# EAGLE design DoublePN-11092017-001 (EAGLE 8.3.1)
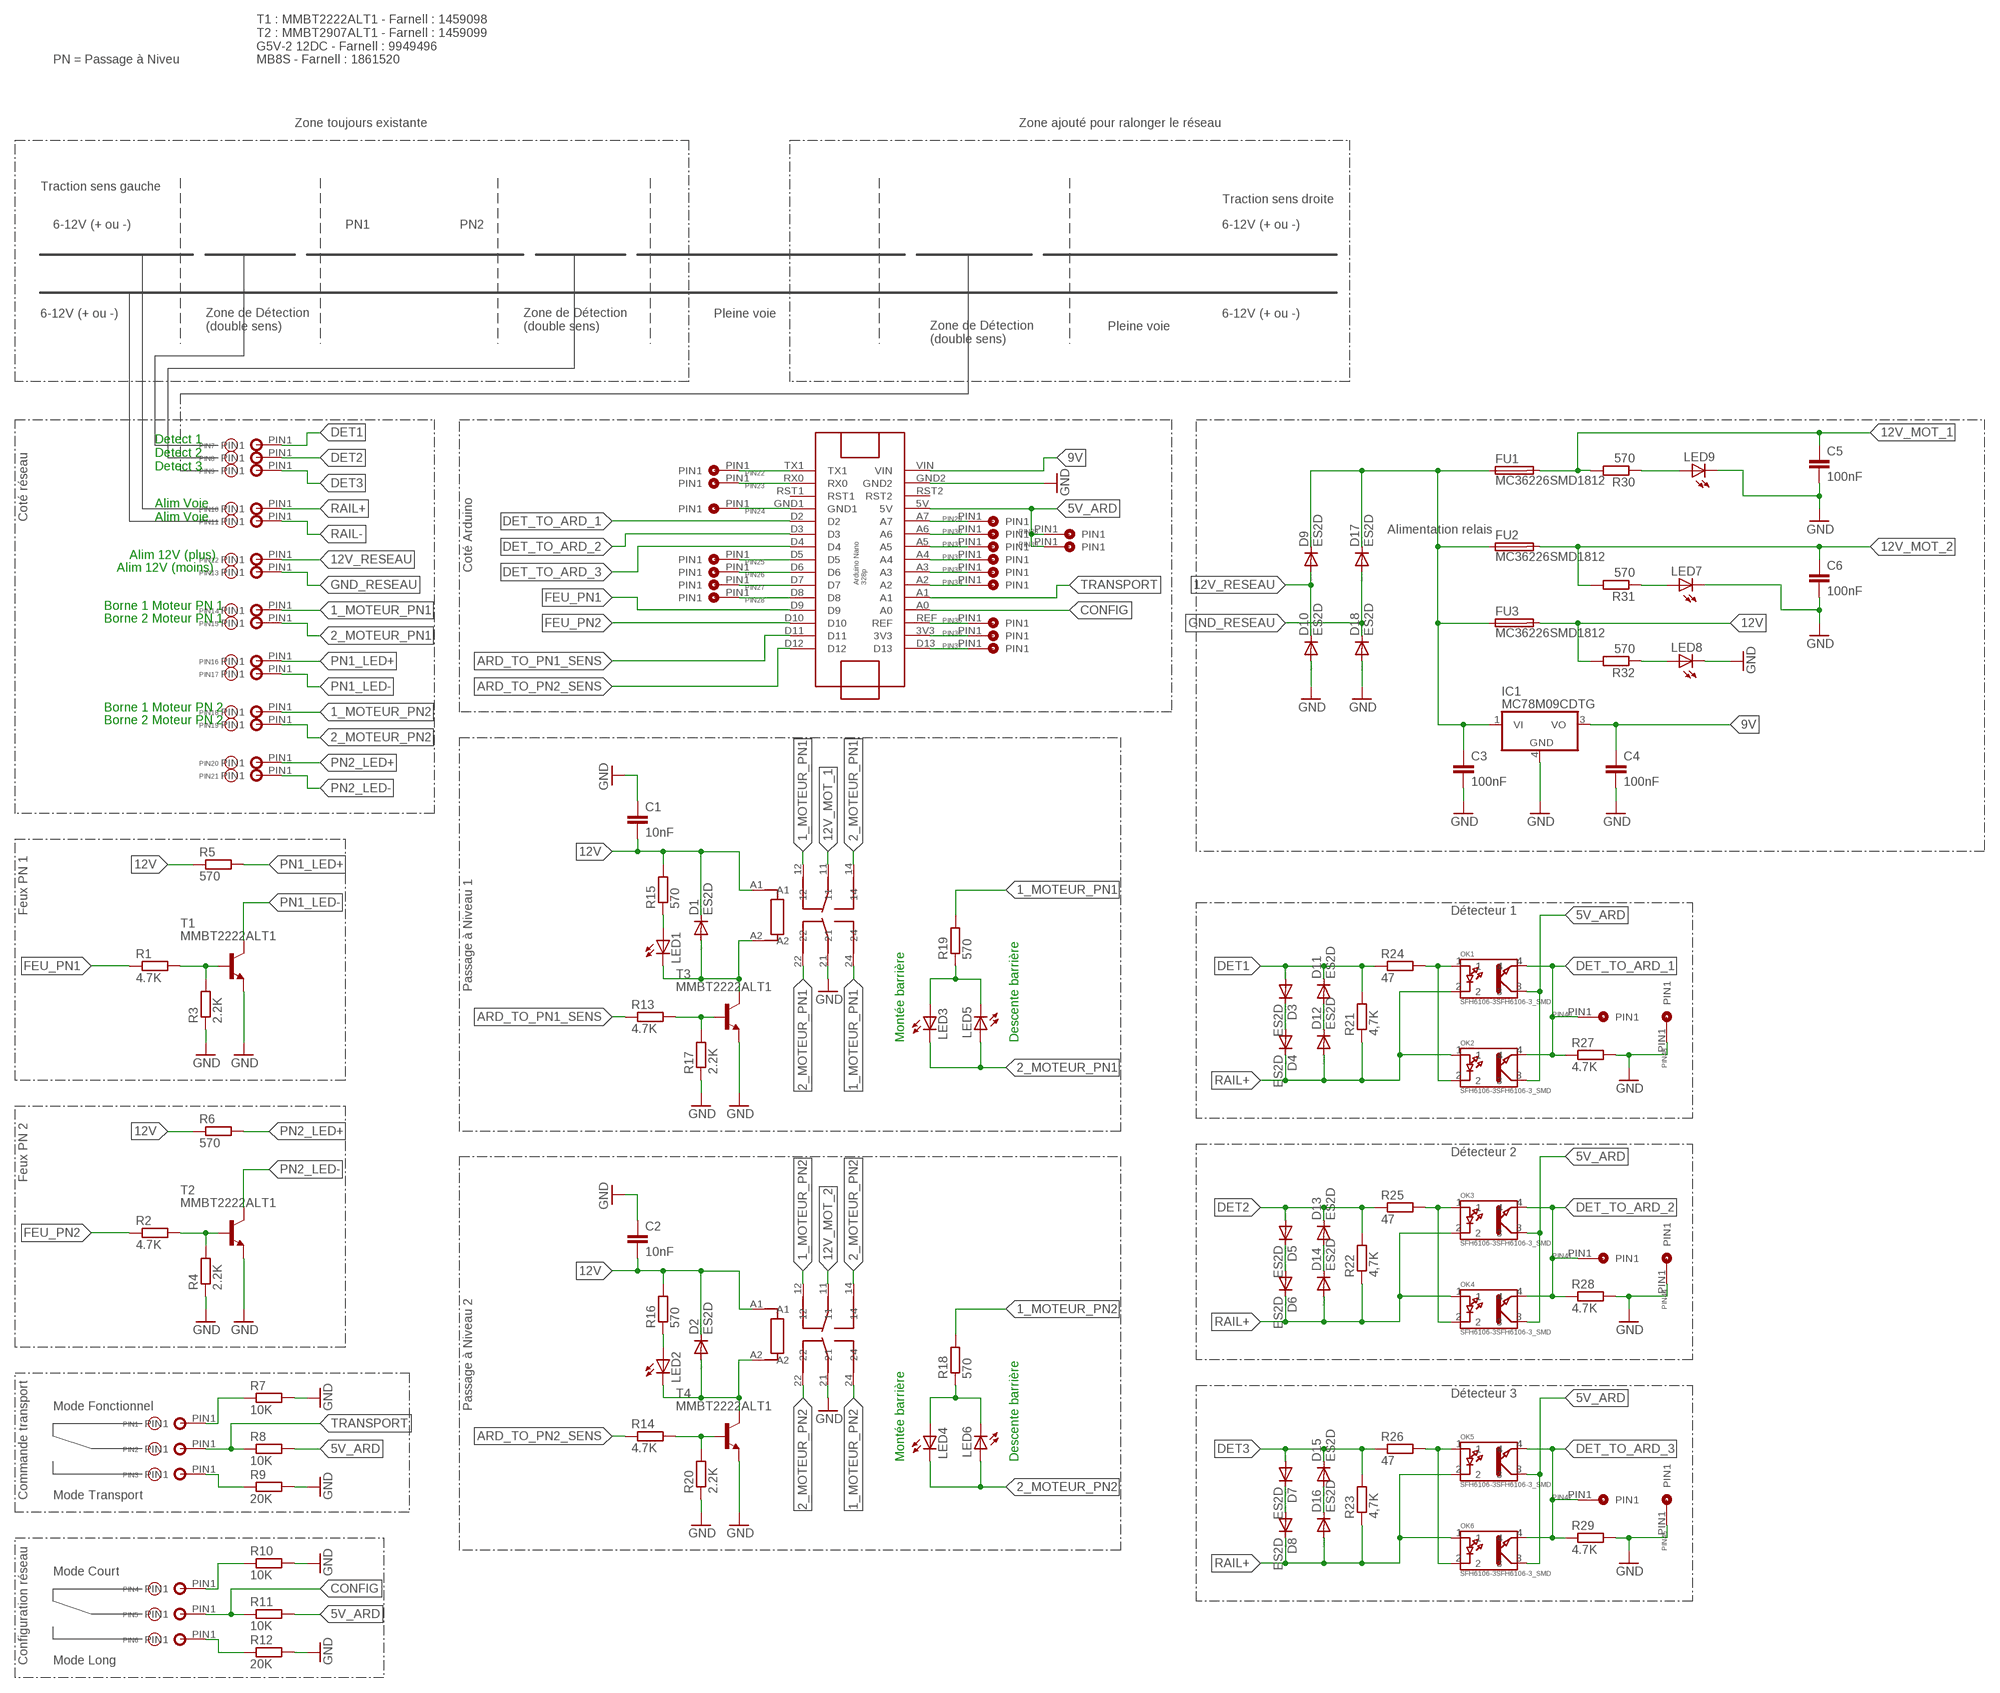
[diagram p0: schematic, sheet 1]

## Parts
ARDUINO-NANO1  ARDUINO-NANO  [ARDUINO-NANO]
C1  10nF  C-EUC0805  [C0805]
C2  10nF  C-EUC0805  [C0805]
C3  100nF  C-EUC0805  [C0805]
C4  100nF  C-EUC0805  [C0805]
C5  100nF  C-EUC0805  [C0805]
C6  100nF  C-EUC0805  [C0805]
D1  ES2D  [SMB]
D2  ES2D  [SMB]
D3  ES2D  [SMB]
D4  ES2D  [SMB]
D5  ES2D  [SMB]
D6  ES2D  [SMB]
D7  ES2D  [SMB]
D8  ES2D  [SMB]
D9  ES2D  [SMB]
D10  ES2D  [SMB]
D11  ES2D  [SMB]
D12  ES2D  [SMB]
D13  ES2D  [SMB]
D14  ES2D  [SMB]
D15  ES2D  [SMB]
D16  ES2D  [SMB]
D17  ES2D  [SMB]
D18  ES2D  [SMB]
FU1  MC36226SMD1812  [MC36226]
FU2  MC36226SMD1812  [MC36226]
FU3  MC36226SMD1812  [MC36226]
IC1  MC78M09CDTG  [DPACK_3]
LED1  LEDCHIPLED_0805  [CHIPLED_0805]
LED2  LEDCHIPLED_0805  [CHIPLED_0805]
LED3  LEDCHIPLED_0805  [CHIPLED_0805]
LED4  LEDCHIPLED_0805  [CHIPLED_0805]
LED5  LEDCHIPLED_0805  [CHIPLED_0805]
LED6  LEDCHIPLED_0805  [CHIPLED_0805]
LED7  LEDCHIPLED_0805  [CHIPLED_0805]
LED8  LEDCHIPLED_0805  [CHIPLED_0805]
LED9  LEDCHIPLED_0805  [CHIPLED_0805]
OK1  SFH6106-3SFH6106-3_SMD  [SFH6106-3]
OK2  SFH6106-3SFH6106-3_SMD  [SFH6106-3]
OK3  SFH6106-3SFH6106-3_SMD  [SFH6106-3]
OK4  SFH6106-3SFH6106-3_SMD  [SFH6106-3]
OK5  SFH6106-3SFH6106-3_SMD  [SFH6106-3]
OK6  SFH6106-3SFH6106-3_SMD  [SFH6106-3]
PIN1  CON-FILTRAVERSANT-1FILTRAVERSANT-1  [CON-FILTRAVERSANT-1]
PIN2  CON-FILTRAVERSANT-1FILTRAVERSANT-1  [CON-FILTRAVERSANT-1]
PIN3  CON-FILTRAVERSANT-1FILTRAVERSANT-1  [CON-FILTRAVERSANT-1]
PIN4  CON-FILTRAVERSANT-1FILTRAVERSANT-1  [CON-FILTRAVERSANT-1]
PIN5  CON-FILTRAVERSANT-1FILTRAVERSANT-1  [CON-FILTRAVERSANT-1]
PIN6  CON-FILTRAVERSANT-1FILTRAVERSANT-1  [CON-FILTRAVERSANT-1]
PIN7  CON-FILTRAVERSANT-1FILTRAVERSANT-1  [CON-FILTRAVERSANT-1]
PIN8  CON-FILTRAVERSANT-1FILTRAVERSANT-1  [CON-FILTRAVERSANT-1]
PIN9  CON-FILTRAVERSANT-1FILTRAVERSANT-1  [CON-FILTRAVERSANT-1]
PIN10  CON-FILTRAVERSANT-1FILTRAVERSANT-1  [CON-FILTRAVERSANT-1]
PIN11  CON-FILTRAVERSANT-1FILTRAVERSANT-1  [CON-FILTRAVERSANT-1]
PIN12  CON-FILTRAVERSANT-1FILTRAVERSANT-1  [CON-FILTRAVERSANT-1]
PIN13  CON-FILTRAVERSANT-1FILTRAVERSANT-1  [CON-FILTRAVERSANT-1]
PIN14  CON-FILTRAVERSANT-1FILTRAVERSANT-1  [CON-FILTRAVERSANT-1]
PIN15  CON-FILTRAVERSANT-1FILTRAVERSANT-1  [CON-FILTRAVERSANT-1]
PIN16  CON-FILTRAVERSANT-1FILTRAVERSANT-1  [CON-FILTRAVERSANT-1]
PIN17  CON-FILTRAVERSANT-1FILTRAVERSANT-1  [CON-FILTRAVERSANT-1]
PIN18  CON-FILTRAVERSANT-1FILTRAVERSANT-1  [CON-FILTRAVERSANT-1]
PIN19  CON-FILTRAVERSANT-1FILTRAVERSANT-1  [CON-FILTRAVERSANT-1]
PIN20  CON-FILTRAVERSANT-1FILTRAVERSANT-1  [CON-FILTRAVERSANT-1]
PIN21  CON-FILTRAVERSANT-1FILTRAVERSANT-1  [CON-FILTRAVERSANT-1]
PIN22  CON-TRAV-1PIN  [CON-TRAV-1]
PIN23  CON-TRAV-1PIN  [CON-TRAV-1]
PIN24  CON-TRAV-1PIN  [CON-TRAV-1]
PIN25  CON-TRAV-1PIN  [CON-TRAV-1]
PIN26  CON-TRAV-1PIN  [CON-TRAV-1]
PIN27  CON-TRAV-1PIN  [CON-TRAV-1]
PIN28  CON-TRAV-1PIN  [CON-TRAV-1]
PIN29  CON-TRAV-1PIN  [CON-TRAV-1]
PIN30  CON-TRAV-1PIN  [CON-TRAV-1]
PIN31  CON-TRAV-1PIN  [CON-TRAV-1]
PIN32  CON-TRAV-1PIN  [CON-TRAV-1]
PIN33  CON-TRAV-1PIN  [CON-TRAV-1]
PIN34  CON-TRAV-1PIN  [CON-TRAV-1]
PIN35  CON-TRAV-1PIN  [CON-TRAV-1]
PIN36  CON-TRAV-1PIN  [CON-TRAV-1]
PIN37  CON-TRAV-1PIN  [CON-TRAV-1]
PIN38  CON-TRAV-1PIN  [CON-TRAV-1]
PIN39  CON-TRAV-1PIN  [CON-TRAV-1]
PIN40  CON-TRAV-1PIN  [CON-TRAV-1]
PIN41  CON-TRAV-1PIN  [CON-TRAV-1]
PIN42  CON-TRAV-1PIN  [CON-TRAV-1]
PIN43  CON-TRAV-1PIN  [CON-TRAV-1]
PIN44  CON-TRAV-1PIN  [CON-TRAV-1]
PIN45  CON-TRAV-1PIN  [CON-TRAV-1]
R1  4.7K  R-EU_R0805  [R0805]
R2  4.7K  R-EU_R0805  [R0805]
R3  2.2K  R-EU_R0805  [R0805]
R4  2.2K  R-EU_R0805  [R0805]
R5  570  R-EU_R0805  [R0805]
R6  570  R-EU_R0805  [R0805]
R7  10K  R-EU_R0805  [R0805]
R8  10K  R-EU_R0805  [R0805]
R9  20K  R-EU_R0805  [R0805]
R10  10K  R-EU_R0805  [R0805]
R11  10K  R-EU_R0805  [R0805]
R12  20K  R-EU_R0805  [R0805]
R13  4.7K  R-EU_R0805  [R0805]
R14  4.7K  R-EU_R0805  [R0805]
R15  570  R-EU_R0805  [R0805]
R16  570  R-EU_R0805  [R0805]
R17  2.2K  R-EU_R0805  [R0805]
R18  570  R-EU_R0805  [R0805]
R19  570  R-EU_R0805  [R0805]
R20  2.2K  R-EU_R0805  [R0805]
R21  4,7K  R-EU_R0805  [R0805]
R22  4,7K  R-EU_R0805  [R0805]
R23  4,7K  R-EU_R0805  [R0805]
R24  47  R-EU_R0805  [R0805]
R25  47  R-EU_R0805  [R0805]
R26  47  R-EU_R0805  [R0805]
R27  4.7K  R-EU_R0805  [R0805]
R28  4.7K  R-EU_R0805  [R0805]
R29  4.7K  R-EU_R0805  [R0805]
R30  570  R-EU_R0805  [R0805]
R31  570  R-EU_R0805  [R0805]
R32  570  R-EU_R0805  [R0805]
RLS1  FINDER-DPDT-12VFINDER-DPDT-12V  [FINDER-DPDT-12V]
RLS2  FINDER-DPDT-12VFINDER-DPDT-12V  [FINDER-DPDT-12V]
T1  MMBT2222ALT1  MMBT2222ALT1-NPN-SOT23-BEC  [SOT23-BEC]
T2  MMBT2222ALT1  MMBT2222ALT1-NPN-SOT23-BEC  [SOT23-BEC]
T3  MMBT2222ALT1  MMBT2222ALT1-NPN-SOT23-BEC  [SOT23-BEC]
T4  MMBT2222ALT1  MMBT2222ALT1-NPN-SOT23-BEC  [SOT23-BEC]

## Nets
1_MOTEUR_PN1: PIN14.PIN1 R19.2 RLS1.12 RLS1.24
1_MOTEUR_PN2: PIN18.PIN1 R18.2 RLS2.12 RLS2.24
2_MOTEUR_PN1: LED3.C LED5.A PIN15.PIN1 RLS1.14 RLS1.22
2_MOTEUR_PN2: LED4.C LED6.A PIN19.PIN1 RLS2.14 RLS2.22
5V_ARD: ARDUINO-NANO1.5V OK1.3 OK2.3 OK3.3 OK4.3 OK5.3 OK6.3 PIN38.PIN1 PIN39.PIN1 R8.2 R11.2
9V: ARDUINO-NANO1.VIN C4.1 IC1.3(VO)
12V: C1.2 C2.2 D1.C D2.C FU3.2 R5.1 R6.1 R15.2 R16.2 R32.2 RLS1.A1 RLS2.A1
12V_MOT_1: C5.1 FU1.2 R30.2 RLS1.11
12V_MOT_2: C6.1 FU2.2 R31.2 RLS2.11
12V_RESEAU: D9.A D10.C PIN12.PIN1
ARD_TO_PN1_SENS: ARDUINO-NANO1.D11 R13.1
ARD_TO_PN2_SENS: ARDUINO-NANO1.D12 R14.1
CONFIG: ARDUINO-NANO1.A0 PIN5.PIN1 R11.1
DET1: D3.A D11.C PIN7.PIN1 R21.2 R24.1
DET2: D5.A D13.C PIN8.PIN1 R22.2 R25.1
DET3: D7.A D15.C PIN9.PIN1 R23.2 R26.1
DET_TO_ARD_1: ARDUINO-NANO1.D2 OK1.4 OK2.4 PIN40.PIN1 R27.1
DET_TO_ARD_2: ARDUINO-NANO1.D3 OK3.4 OK4.4 PIN41.PIN1 R28.1
DET_TO_ARD_3: ARDUINO-NANO1.D4 OK5.4 OK6.4 PIN42.PIN1 R29.1
FEU_PN1: ARDUINO-NANO1.D9 R1.1
FEU_PN2: ARDUINO-NANO1.D10 R2.1
GND: ARDUINO-NANO1.GND2 C1.1 C2.1 C3.2 C4.2 C5.2 C6.2 D10.A D18.A IC1.4(GND) LED7.C LED8.C LED9.C PIN43.PIN1 PIN44.PIN1 PIN45.PIN1 R3.1 R4.1 R7.2 R9.2 R10.2 R12.2 R17.1 R20.1 R27.2 R28.2 R29.2 RLS1.21 RLS2.21 T1.E T2.E T3.E T4.E
GND_RESEAU: D17.A D18.C PIN13.PIN1
N$1: OK1.1 OK2.2 R24.2
N$2: D3.C D4.A
N$3: D11.A D12.C
N$4: LED3.A LED5.C R19.1
N$5: R13.2 R17.2 T3.B
N$6: D5.C D6.A
N$7: D1.A LED1.C RLS1.A2 T3.C
N$8: D13.A D14.C
N$9: LED1.A R15.1
N$10: OK3.1 OK4.2 R25.2
N$11: D7.C D8.A
N$12: D15.A D16.C
N$13: OK5.1 OK6.2 R26.2
N$14: D2.A LED2.C RLS2.A2 T4.C
N$15: LED9.A R30.1
N$16: LED4.A LED6.C R18.1
N$17: R14.2 R20.2 T4.B
N$18: LED2.A R16.1
N$19: ARDUINO-NANO1.GND1 PIN24.PIN1
N$20: R2.2 R4.2 T2.B
N$21: ARDUINO-NANO1.D7 PIN27.PIN1
N$22: R1.2 R3.2 T1.B
N$23: ARDUINO-NANO1.D8 PIN28.PIN1
N$24: LED7.A R31.1
N$25: ARDUINO-NANO1.A7 PIN29.PIN1
N$26: ARDUINO-NANO1.A6 PIN30.PIN1
N$27: ARDUINO-NANO1.A5 PIN31.PIN1
N$28: ARDUINO-NANO1.A4 PIN32.PIN1
N$29: ARDUINO-NANO1.A3 PIN33.PIN1
N$30: ARDUINO-NANO1.A2 PIN34.PIN1
N$33: ARDUINO-NANO1.D6 PIN26.PIN1
N$34: ARDUINO-NANO1.D5 PIN25.PIN1
N$35: ARDUINO-NANO1.RX0 PIN23.PIN1
N$36: ARDUINO-NANO1.TX1 PIN22.PIN1
N$37: PIN4.PIN1 R10.1
N$38: PIN1.PIN1 R7.1
N$39: ARDUINO-NANO1.REF PIN35.PIN1
N$40: ARDUINO-NANO1.3V3 PIN36.PIN1
N$41: ARDUINO-NANO1.D13 PIN37.PIN1
N$42: PIN6.PIN1 R12.1
N$43: PIN3.PIN1 R9.1
N$44: C3.1 D9.C D17.C FU1.1 FU2.1 FU3.1 IC1.1(VI)
N$45: LED8.A R32.1
PN1_LED+: PIN16.PIN1 R5.2
PN1_LED-: PIN17.PIN1 T1.C
PN2_LED+: PIN20.PIN1 R6.2
PN2_LED-: PIN21.PIN1 T2.C
RAIL+: D4.C D6.C D8.C D12.A D14.A D16.A OK1.2 OK2.1 OK3.2 OK4.1 OK5.2 OK6.1 PIN10.PIN1 R21.1 R22.1 R23.1
RAIL-: PIN11.PIN1
TRANSPORT: ARDUINO-NANO1.A1 PIN2.PIN1 R8.1
Unconnected: ARDUINO-NANO1.RST1 ARDUINO-NANO1.RST2

## Notes on the sheet
- PN = Passage à Niveu
- T1 : MMBT2222ALT1 - Farnell : 1459098
  T2 : MMBT2907ALT1 - Farnell : 1459099
  G5V-2 12DC - Farnell : 9949496
  MB8S - Farnell : 1861520
- Zone toujours existante | Zone ajouté pour ralonger le réseau
- Traction sens gauche
- Traction sens droite
- 6-12V (+ ou -) | PN1 | PN2 | 6-12V (+ ou -)
- 6-12V (+ ou -) | Pleine voie | 6-12V (+ ou -)
- Zone de Détection
  (double sens)
- Zone de Détection
  (double sens)
- Pleine voie
- Zone de Détection
  (double sens)
- Detect 1
  Detect 2
  Detect 3
- Coté réseau
- Alim Voie
  Alim Voie
- Alimentation relais
- Alim 12V (plus)
- Alim 12V (moins) | Coté Arduino
- Borne 1 Moteur PN 1
- Borne 2 Moteur PN 1
- Borne 1 Moteur PN 2
- Borne 2 Moteur PN 2
- Feux PN 1 | Détecteur 1
- Passage à Niveau 1
- Montée barrière | Descente barrière
- Détecteur 2
- Feux PN 2
- Détecteur 3
- Mode Fonctionnel | Passage à Niveau 2
- Montée barrière | Descente barrière
- Commande transport | Mode Transport
- Mode Court
- Configuration réseau | Mode Long

## Library data of the parts
ARDUINO-NANO1 = Arduino-nano:ARDUINO-NANO
C1-C6 = rcl:C-EU: CAPACITOR, European symbol
D1-D18 = diode:ES2D: DIODE super fast rectifier, 2 A
FU1-FU3 = Alex-Poly:MC36226
IC1 = linear:MC78M: 500 mA Positive Voltage Regulators Source: Data sheet <http://www.onsemi.com/pub_link/Collateral/MC78M00-D.PDF>
LED1-LED9 = led:LED: LED OSRAM: - CHIPLED LG R971, LG N971, LY N971, LG Q971, LY Q971, LO R971, LY R971 LH N974, LH R974 LS Q976, LO Q976, LY Q976 LO Q996 - Hyper CHIPLED LW Q18S LB Q993, LB Q99A, LB R99A - SideLED LS A670, LO A670, LY A670, LG A670, LP A670 LB A673, LV A673, LT A673, LW A673 LH A674 LY A675 LS A676, LA A676, LO A676, LY A676, LW A676 LS A679, LY A679, LG A679 - Hyper Micro SIDELED® LS Y876, LA Y876, LO Y876, LY Y876 LT Y87S - SmartLED LW L88C, LW L88S LB L89C, LB L89S, LG L890 LS L89K, LO L89K, LY L89K LS L896, LA L896, LO L896, LY L896 - TOPLED LS T670, LO T670, LY T670, LG T670, LP T670 LSG T670, LSP T670, LSY T670, LOP T670, LYG T670 LG T671, LOG T671, LSG T671 LB T673, LV T673, LT T673, LW T673 LH T674 LS T676, LA T676, LO T676, LY T676, LB T676, LH T676, LSB T676, LW T676 LB T67C, LV T67C, LT T67C, LS T67K, LO T67K, LY T67K, LW E67C LS E67B, LA E67B, LO E67B, LY E67B, LB E67C, LV E67C, LT E67C LW T67C LS T679, LY T679, LG T679 LS T770, LO T770, LY T770, LG T770, LP T770 LB T773, LV T773, LT T773, LW T773 LH T774 LS E675, LA E675, LY E675, LS T675 LS T776, LA T776, LO T776, LY T776, LB T776 LHGB T686 LT T68C, LB T68C - Hyper Mini TOPLED® LB M676 - Mini TOPLED Santana® LG M470 LS M47K, LO M47K, LY M47K Source: http://www.osram.convergy.de LUXEON: - LUMILED® LXK2-PW12-R00, LXK2-PW12-S00, LXK2-PW14-U00, LXK2-PW14-V00 LXK2-PM12-R00, LXK2-PM12-S00, LXK2-PM14-U00 LXK2-PE12-Q00, LXK2-PE12-R00, LXK2-PE12-S00, LXK2-PE14-T00, LXK2-PE14-U00 LXK2-PB12-K00, LXK2-PB12-L00, LXK2-PB12-M00, LXK2-PB14-N00, LXK2-PB14-P00, LXK2-PB14-Q00 LXK2-PR12-L00, LXK2-PR12-M00, LXK2-PR14-Q00, LXK2-PR14-R00 LXK2-PD12-Q00, LXK2-PD12-R00, LXK2-PD12-S00 LXK2-PH12-R00, LXK2-PH12-S00 LXK2-PL12-P00, LXK2-PL12-Q00, LXK2-PL12-R00 Source: www.luxeon.com KINGBRIGHT: KA-3528ASYC Source: www.kingbright.com
OK1-OK6 = Alex-Optocoupler:SFH6106-3
PIN1-PIN21 = Pin:CON-FILTRAVERSANT-1
PIN22-PIN45 = Pin:CON-TRAV-1
R1-R32 = rcl:R-EU_: RESISTOR, European symbol
RLS1 RLS2 = Alex-Relay:FINDER-DPDT-12V
T1-T4 = transistor:*-NPN-: NPN Transistror BF959 corrected 2008.03.06

## Board
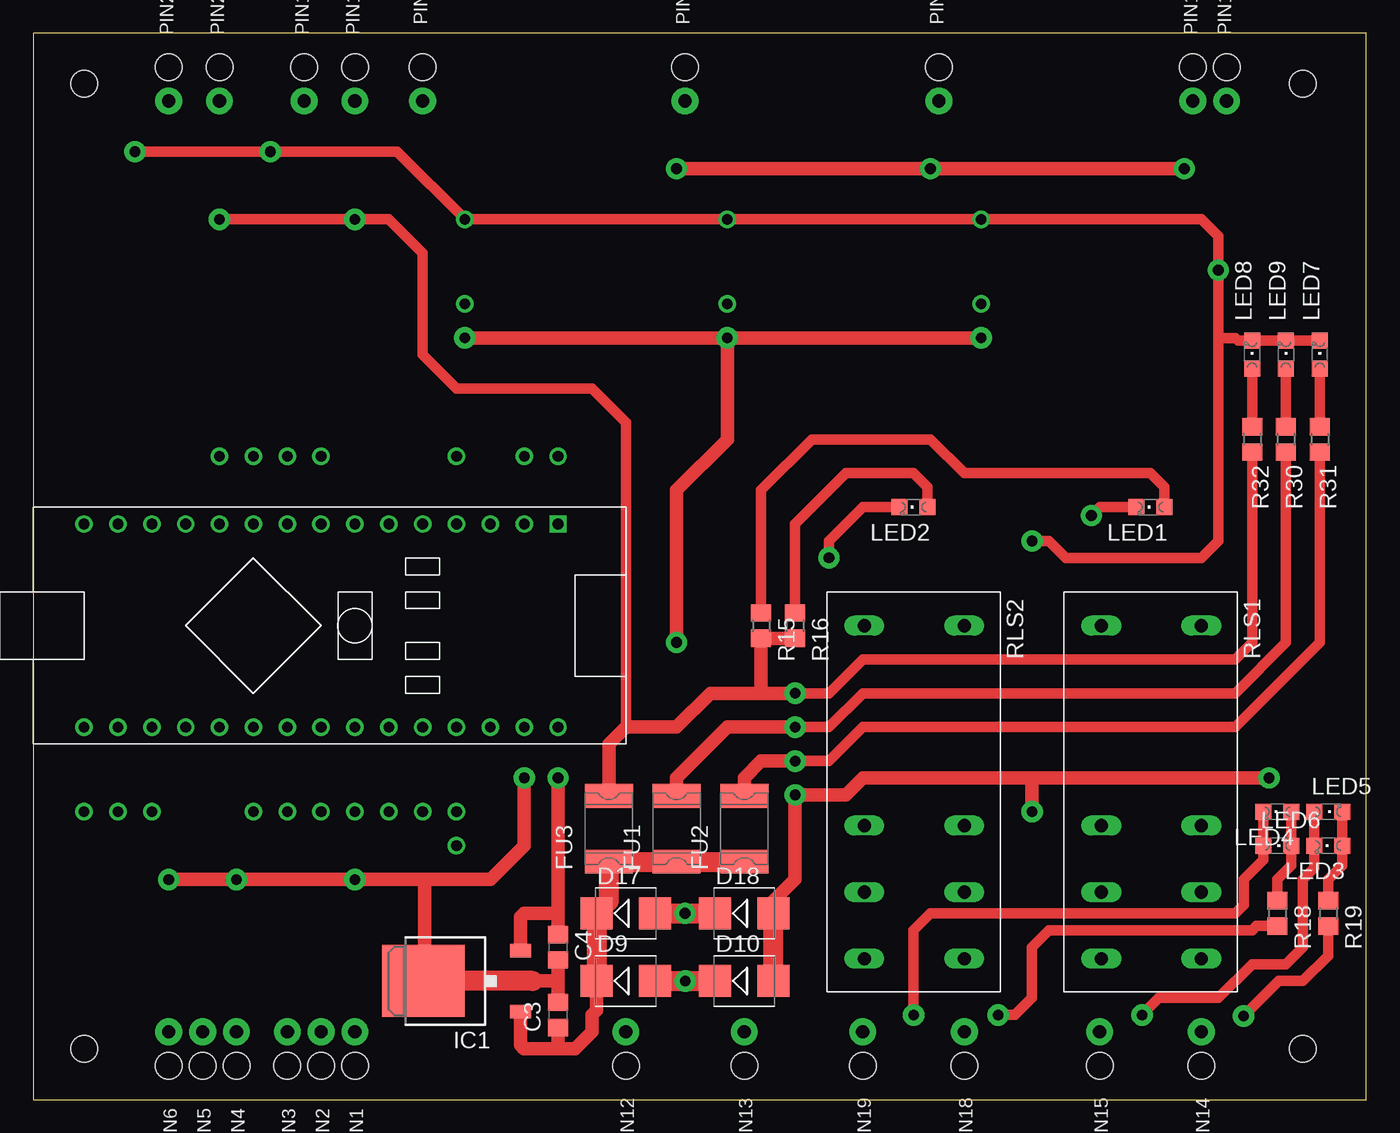
[diagram p1: board, top side]
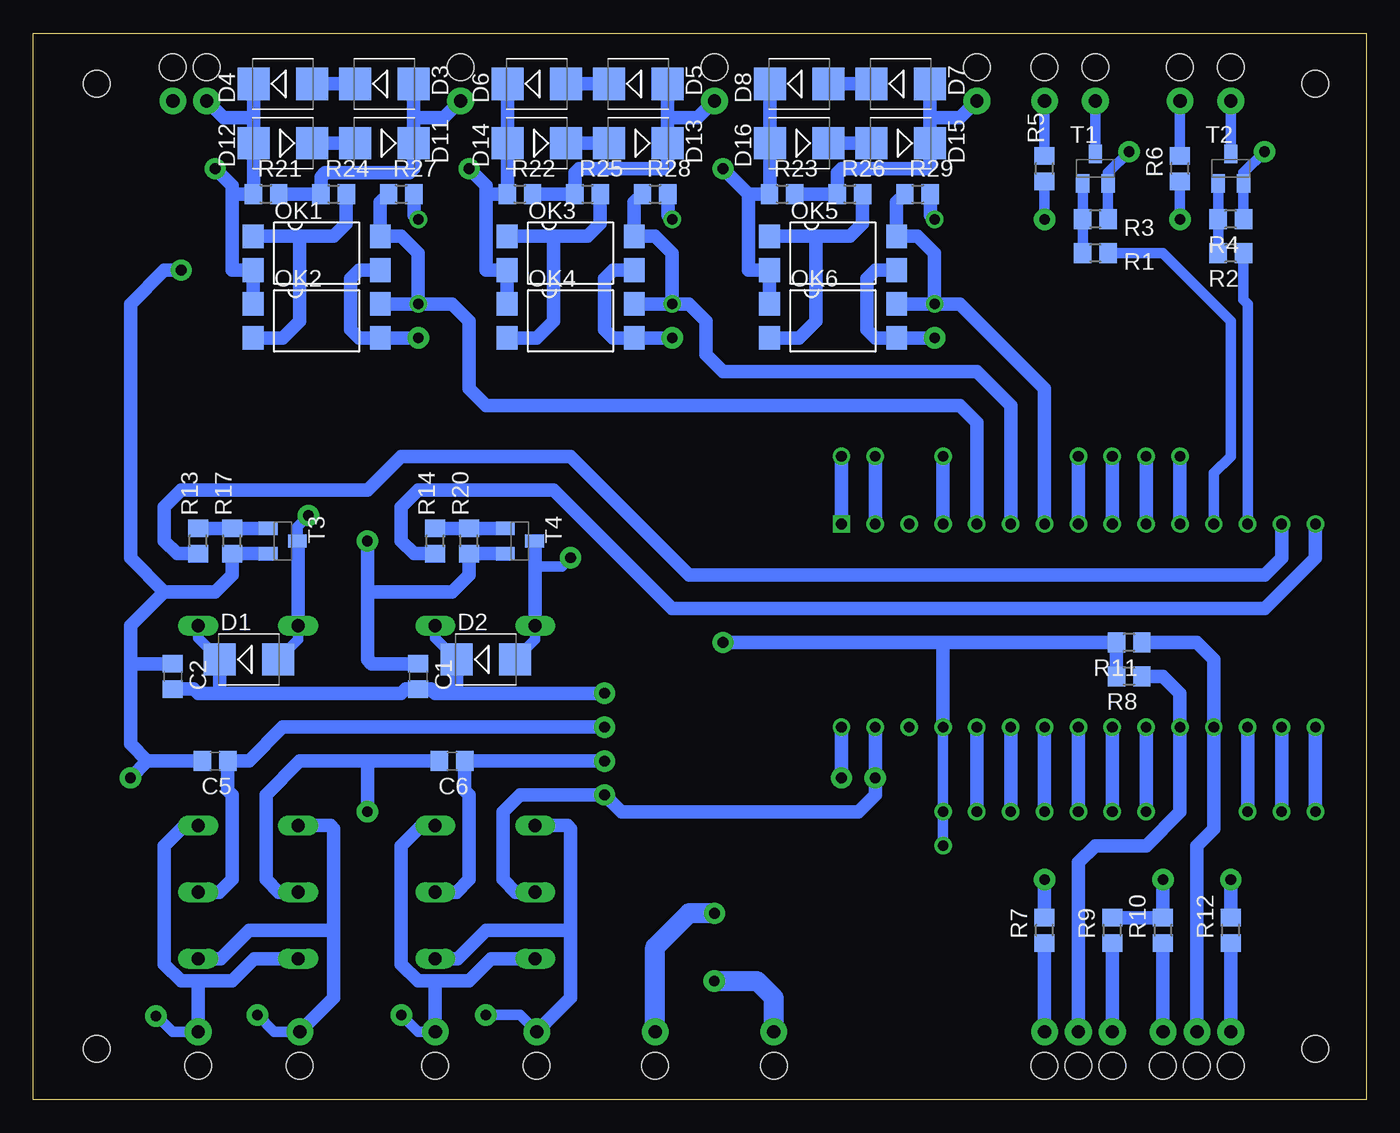
[diagram p2: board, bottom side, seen from below]

Size 100 x 80 mm. Coordinates in mm from the lower left corner, seen from the top.
Outline: 0,0 100,0 100,80 0,80 0,0
Copper layers (1*16): Top 0.035mm / dielectric 1.5mm / Bottom 0.035mm
Design rules "default": minimum track width 6mil, minimum drill 0.35mm, track to track 6mil, track to pad 6mil, pad to pad 6mil, via to via 6mil, smd to smd 6mil, copper to edge 40mil, drill to drill 6mil, minimum pad ring 10mil, minimum via ring 8mil, stop-mask expansion 4mil, vias tented up to drill 0mil, thermal gap 10mil
Holes 2 mm at 3.81,76.2 95.25,76.2 95.25,3.81 3.81,3.81

### Footprints (pad centres in the part's own frame; a part is rotated, then mirrored left to right if it is on the bottom)
ARDUINO-NANO = drill 0.8: 3V3 7.62,-16.51; 5V 7.62,8.89; A0 7.62,-11.43; A1 7.62,-8.89; A2 7.62,-6.35; A3 7.62,-3.81; A4 7.62,-1.27; A5 7.62,1.27; A6 7.62,3.81; A7 7.62,6.35; D2 -7.62,6.35; D3 -7.62,3.81; D4 -7.62,1.27; D5 -7.62,-1.27; D6 -7.62,-3.81; D7 -7.62,-6.35; D8 -7.62,-8.89; D9 -7.62,-11.43; D10 -7.62,-13.97; D11 -7.62,-16.51; D12 -7.62,-19.05; D13 7.62,-19.05; GND1 -7.62,8.89; GND2 7.62,13.97; REF 7.62,-13.97; RST1 -7.62,11.43; RST2 7.62,11.43; RX0 -7.62,13.97; VIN 7.62,16.51 | drill 0.8 square: TX1 -7.62,16.51
C0805 = smd 1.3 x 1.5: 1 -0.95,0; 2 0.95,0
SMB = smd 2.4 x 2.4: A 2.2,0; C -2.2,0
MC36226 = smd 1.78 x 3.6: 1 -2.47,0; 2 2.47,0
DPACK_3 = smd 1 x 1.6: 1 -2.28,-4.8; 3 2.28,-4.8 | smd 5.4 x 6.2: 4 0,2.5
CHIPLED_0805 = smd 1.2 x 1.2: A 0,-1.05; C 0,1.05
SFH6106-3 = smd 1.78 x 1.55: 1 -1.27,-4.77; 2 1.27,-4.77; 3 1.27,4.77; 4 -1.27,4.77
CON-FILTRAVERSANT-1 = drill 1 pad 2: PIN1 0,0 | hole 2: -2.54,0
CON-TRAV-1 = drill 0.8 pad 1.2: PIN1 0,0
R0805 = smd 1.3 x 1.5: 1 -0.95,0; 2 0.95,0
FINDER-DPDT-12V = drill 1 long: 11 -3.81,6.03; 12 -3.81,1.03; 14 -3.81,11.03; 21 3.69,6.03; 22 3.69,1.03; 24 3.69,11.03; A1 -3.81,-13.97; A2 3.69,-13.97
SOT23-BEC = smd 1 x 1.4: B -0.95,-1.1; C 0,1.1; E 0.95,-1.1

### Placement (x,y rotation side)
ARDUINO-NANO1  22.86,35.56 270 top
C1  71.12,31.75 270 bottom
C2  89.53,31.75 270 bottom
C3  39.37,6.35 90 top
C4  39.37,11.43 270 top
C5  86.36,25.4 180 bottom
C6  68.58,25.4 180 bottom
D1  83.82,33.02 0 bottom
D2  66.04,33.02 0 bottom
D3  73.66,76.2 0 bottom
D4  81.28,76.2 0 bottom
D5  54.61,76.2 0 bottom
D6  62.23,76.2 0 bottom
D7  34.92,76.2 0 bottom
D8  42.55,76.2 0 bottom
D9  44.45,8.89 0 top
D10  53.34,8.89 0 top
D11  73.66,71.75 180 bottom
D12  81.28,71.75 180 bottom
D13  54.61,71.75 180 bottom
D14  62.23,71.75 180 bottom
D15  34.92,71.75 180 bottom
D16  42.55,71.75 180 bottom
D17  44.45,13.97 0 top
D18  53.34,13.97 0 top
FU1  48.26,20.32 90 top
FU2  53.34,20.32 90 top
FU3  43.18,20.32 90 top
IC1  31.75,8.89 90 top
LED1  83.82,44.45 90 top
LED2  66.04,44.45 90 top
LED3  97.16,19.05 90 top
LED4  93.34,21.59 90 top
LED5  97.16,21.59 270 top
LED6  93.34,19.05 270 top
LED7  96.52,55.88 0 top
LED8  91.44,55.88 0 top
LED9  93.98,55.88 0 top
OK1  78.74,63.5 270 bottom
OK2  78.74,58.42 270 bottom
OK3  59.69,63.5 270 bottom
OK4  59.69,58.42 270 bottom
OK5  40.01,63.5 270 bottom
OK6  40.01,58.42 270 bottom
PIN1  24.13,5.08 90 top
PIN2  21.59,5.08 90 top
PIN3  19.05,5.08 90 top
PIN4  15.24,5.08 90 top
PIN5  12.7,5.08 90 top
PIN6  10.16,5.08 90 top
PIN7  67.94,74.93 270 top
PIN8  48.9,74.93 270 top
PIN9  29.21,74.93 270 top
PIN10  87,74.93 270 top
PIN11  89.53,74.93 270 top
PIN12  44.45,5.08 90 top
PIN13  53.34,5.08 90 top
PIN14  87.63,5.08 90 top
PIN15  80.01,5.08 90 top
PIN16  24.13,74.93 270 top
PIN17  20.32,74.93 270 top
PIN18  69.85,5.08 90 top
PIN19  62.23,5.08 90 top
PIN20  13.97,74.93 270 top
PIN21  10.16,74.93 270 top
PIN22  39.37,48.26 0 top
PIN23  36.83,48.26 0 top
PIN24  31.75,48.26 0 top
PIN25  21.59,48.26 0 top
PIN26  19.05,48.26 0 top
PIN27  16.51,48.26 0 top
PIN28  13.97,48.26 0 top
PIN29  29.21,21.59 0 top
PIN30  26.67,21.59 0 top
PIN31  24.13,21.59 0 top
PIN32  21.59,21.59 0 top
PIN33  19.05,21.59 0 top
PIN34  16.51,21.59 0 top
PIN35  8.89,21.59 0 top
PIN36  6.35,21.59 0 top
PIN37  3.81,21.59 0 top
PIN38  31.75,21.59 0 top
PIN39  31.75,19.05 0 top
PIN40  71.12,59.69 90 bottom
PIN41  52.07,59.69 0 top
PIN42  32.38,59.69 0 top
PIN43  71.12,66.04 0 top
PIN44  52.07,66.04 0 top
PIN45  32.38,66.04 0 top
R1  20.32,63.5 180 bottom
R2  10.16,63.5 180 bottom
R3  20.32,66.04 180 bottom
R4  10.16,66.04 180 bottom
R5  24.13,69.85 90 bottom
R6  13.97,69.85 90 bottom
R7  24.13,12.7 90 bottom
R8  17.78,31.75 180 bottom
R9  19.05,12.7 90 bottom
R10  15.24,12.7 90 bottom
R11  17.78,34.29 180 bottom
R12  10.16,12.7 90 bottom
R13  87.63,41.91 90 bottom
R14  69.85,41.91 90 bottom
R15  54.61,35.56 270 top
R16  57.15,35.56 270 top
R17  85.09,41.91 90 bottom
R18  93.34,13.97 270 top
R19  97.16,13.97 270 top
R20  67.31,41.91 90 bottom
R21  82.55,67.94 0 bottom
R22  63.5,67.94 0 bottom
R23  43.81,67.94 0 bottom
R24  77.47,67.94 0 bottom
R25  58.42,67.94 0 bottom
R26  38.73,67.94 0 bottom
R27  72.39,67.94 0 bottom
R28  53.34,67.94 0 bottom
R29  33.66,67.94 0 bottom
R30  93.98,49.53 270 top
R31  96.52,49.53 270 top
R32  91.44,49.53 270 top
RLS1  83.82,21.59 180 top
RLS2  66.04,21.59 180 top
T1  20.32,69.85 0 bottom
T2  10.16,69.85 0 bottom
T3  81.28,41.91 270 bottom
T4  63.5,41.91 270 bottom

### Tracks (layer width: path | path; a pad name or v marks a point on that pad's centre or on a via)
1_MOTEUR_PN1  (via drill 0.8 pad 1.6)
  Top 0.8: v90.81,6.27 93.43,8.89 95.25,8.89 97.16,10.79 R19.2
  Bottom 0.8: PIN14.PIN1 89.53,5.08 90.81,6.35 v90.81,6.27
  Bottom 1: RLS1.12 88.66,20.56 90.17,19.05 90.17,10.16 88.9,8.89 87.63,8.89 | 87.63,8.89 85.09,8.89 83.42,10.56 RLS1.24 | 87.63,8.89 PIN14.PIN1
1_MOTEUR_PN2  (via drill 0.8 pad 1.6)
  Top 0.8: v72.39,6.35 73.66,6.35 74.93,7.62 74.93,11.43 76.2,12.7 91.44,12.7 91.76,13.02 R18.2
  Bottom 0.8: PIN18.PIN1 71.12,5.08 v72.39,6.35
  Bottom 1: RLS2.24 65.64,10.56 67.31,8.89 69.85,8.89 | 69.85,8.89 71.12,8.89 72.39,10.16 72.39,19.05 70.88,20.56 RLS2.12 | 69.85,8.89 PIN18.PIN1
2_MOTEUR_PN1  (via drill 0.8 pad 1.6)
  Top 0.8: v83.19,6.35 84.45,7.62 88.9,7.62 91.44,10.16 93.98,10.16 95.25,11.43 95.25,16.51 96.11,17.36 LED3.C LED5.A
  Bottom 0.8: PIN15.PIN1 81.92,5.08 v83.19,6.35
  Bottom 1: RLS1.14 85.96,10.56 83.82,12.7 77.47,12.7 | RLS1.22 77.71,20.56 77.47,20.32 77.47,12.7 | 77.47,12.7 77.47,7.62 PIN15.PIN1
2_MOTEUR_PN2  (via drill 0.8 pad 1.6)
  Top 0.8: v66.04,6.35 66.04,12.7 67.31,13.97 90.17,13.97 90.81,14.61 90.81,16.51 92.3,18 LED6.A LED4.C
  Bottom 0.8: PIN19.PIN1 63.5,6.35 v66.04,6.35
  Bottom 1: RLS2.14 68.18,10.56 66.04,12.7 59.97,12.7 59.69,12.98 | RLS2.22 59.93,20.56 59.69,20.32 59.69,12.98 | 59.69,12.98 59.69,7.62 PIN19.PIN1
5V_ARD  (via drill 0.8 pad 1.6)
  Top 1: v32.38,57.15 v52.07,57.15 | v48.26,34.29 48.26,45.72 52.07,49.53 v52.07,57.15 | v52.07,57.15 v71.12,57.15
  Bottom 0.8: ARDUINO-NANO1.5V PIN38.PIN1 PIN39.PIN1
  Bottom 1: OK1.3 75.56,62.23 76.2,61.59 76.2,57.78 75.56,57.15 OK2.3 v71.12,57.15 | OK3.3 56.52,62.23 57.15,61.59 57.15,57.78 56.52,57.15 OK4.3 v52.07,57.15 | OK5.3 36.83,62.23 37.47,61.59 37.47,57.78 36.83,57.15 OK6.3 v32.38,57.15 | R8.2 R11.2 31.75,34.29 | 31.75,34.29 ARDUINO-NANO1.5V | 31.75,34.29 v48.26,34.29
9V  (via drill 0.8 pad 1.6)
  Top 1: IC1.3 36.55,13.69 36.83,13.97 39.37,13.97 | C4.1 39.37,13.97 | 39.37,13.97 v39.37,24.13
  Bottom 1: v39.37,24.13 ARDUINO-NANO1.VIN
12V  (via drill 0.8 pad 1.6)
  Top 0.8: 57.15,30.61 57.28,30.48 v57.15,30.48 59.69,30.48 62.23,33.02 90.17,33.02 91.44,34.29 R32.2 | v13.97,66.04 v24.13,66.04 26.67,66.04 29.21,63.5 29.21,55.88 31.75,53.34 41.91,53.34 44.45,50.8 44.45,27.94
  Top 1: FU3.2 43.18,26.67 44.45,27.94 48.26,27.94 50.8,30.48 54.61,30.48 | R16.2 R15.2 54.61,30.48 | 54.61,30.48 57.02,30.48 57.15,30.61
  Bottom 0.8: RLS1.A1 87.63,34.63 D1.C | RLS2.A1 69.85,34.63 D2.C | R6.1 v13.97,66.04 | R5.1 v24.13,66.04
  Bottom 1: 68.4,30.48 69.85,30.48 70.17,30.8 C1.2 72.07,30.8 72.39,30.48 85.94,30.48 | 68.4,30.48 v57.15,30.48 | D2.C 68.24,30.64 68.4,30.48 | 85.94,30.48 87.63,30.48 87.95,30.8 C2.2 | D1.C 86.02,30.56 85.94,30.48
12V_MOT_1  (via drill 0.8 pad 1.6)
  Top 0.8: v57.15,27.94 59.69,27.94 62.23,30.48 90.17,30.48 93.98,34.29 R30.2
  Top 1: FU1.2 48.26,24.13 52.07,27.94 v57.15,27.94
  Bottom 1: RLS1.11 86.04,15.56 85.09,16.51 85.09,22.86 85.41,23.18 C5.1 83.82,25.4 81.28,27.94 v57.15,27.94
12V_MOT_2  (via drill 0.8 pad 1.6)
  Top 0.8: v57.15,25.4 59.69,25.4 62.23,27.94 90.17,27.94 96.52,34.29 R31.2
  Top 1: FU2.2 53.34,24.13 54.61,25.4 v57.15,25.4
  Bottom 1: RLS2.11 68.26,15.56 67.31,16.51 67.31,22.86 67.63,23.18 C6.1 v57.15,25.4
12V_RESEAU  (via drill 0.8 pad 1.6)
  Top 1.5: D10.C v48.9,8.89 D9.A
  Bottom 1.5: v48.9,8.89 45.72,8.89 44.45,7.62 PIN12.PIN1
ARD_TO_PN1_SENS
  Bottom 1: R13.1 89.22,40.96 90.17,41.91 90.17,44.45 88.9,45.72 74.93,45.72 72.39,48.26 59.69,48.26 50.8,39.37 7.62,39.37 6.35,40.64 ARDUINO-NANO1.D11
ARD_TO_PN2_SENS
  Bottom 1: R14.1 71.44,40.96 72.39,41.91 72.39,44.45 71.12,45.72 60.96,45.72 52.07,36.83 7.62,36.83 3.81,40.64 ARDUINO-NANO1.D12
CONFIG
  Bottom 1: R11.1 12.7,34.29 11.43,33.02 ARDUINO-NANO1.A0 11.43,20.32 12.7,19.05 PIN5.PIN1
DET1
  Bottom 1: 71.46,73.49 D11.C 71.46,69.83 71.75,69.53 78.11,69.53 78.42,69.22 R24.1 R21.2 | 71.46,73.49 D3.A | PIN7.PIN1 69.22,73.66 71.29,73.66 71.46,73.49
DET2
  Bottom 1: 52.41,73.66 D13.C 52.41,70.14 52.7,69.85 59.05,69.85 59.37,69.53 R25.1 R22.2 | 52.41,73.66 D5.A | PIN8.PIN1 50.16,73.66 52.41,73.66
DET3
  Bottom 1: 32.73,73.61 D7.A | 32.73,73.61 D15.C 32.73,70.14 33.02,69.85 39.37,69.85 39.69,69.53 R26.1 R23.2 | PIN9.PIN1 30.48,73.66 32.67,73.66 32.73,73.61
DET_TO_ARD_1
  Bottom 1: R27.1 73.97,67.31 OK1.4 72.39,64.77 71.12,63.5 PIN40.PIN1 | PIN40.PIN1 OK2.4 | ARDUINO-NANO1.D2 29.21,50.8 30.48,52.07 66.04,52.07 67.31,53.34 67.31,58.42 68.58,59.69 PIN40.PIN1
DET_TO_ARD_2
  Bottom 1: R28.1 54.92,67.31 OK3.4 53.34,64.77 52.07,63.5 PIN41.PIN1 | PIN41.PIN1 OK4.4 | ARDUINO-NANO1.D3 26.67,52.07 29.21,54.61 48.26,54.61 49.53,55.88 49.53,58.42 50.8,59.69 PIN41.PIN1
DET_TO_ARD_3
  Bottom 1: PIN42.PIN1 32.38,63.5 33.66,64.77 OK5.4 35.23,67.31 R29.1 | PIN42.PIN1 OK6.4 | PIN42.PIN1 30.48,59.69 24.13,53.34 ARDUINO-NANO1.D4
FEU_PN1
  Bottom 0.8: R1.1 15.24,63.5 10.16,58.42 10.16,48.26 11.43,46.99 ARDUINO-NANO1.D9
FEU_PN2
  Bottom 0.8: ARDUINO-NANO1.D10 8.89,59.69 9.21,60.01 R2.1
GND  (via drill 0.8 pad 1.6)
  Top 0.8: LED7.C LED9.C LED8.C 90.39,56.93 90.17,57.15 89.08,57.15 88.9,56.97 | v7.62,71.12 v17.78,71.12 27.3,71.12 PIN45.PIN1 PIN44.PIN1 PIN43.PIN1 87.63,66.04 88.9,64.77 v88.9,62.23 88.9,56.97 | v74.93,41.91 76.2,41.91 77.47,40.64 87.63,40.64 88.9,41.91 88.9,56.97
  Top 1: D18.A 55.54,14.9 57.15,16.51 v57.15,22.86 60.96,22.86 62.23,24.13 74.93,24.13 | 74.93,24.13 v92.71,24.13 | 74.93,24.13 v74.93,21.59 | v10.16,16.51 v15.24,16.51 v24.13,16.51 29.35,16.51 | 29.35,16.51 29.35,8.99 IC1.4 | 29.35,16.51 34.29,16.51 36.83,19.05 v36.83,24.13 | C4.2 39.37,8.89 | 39.37,8.89 C3.2 | 39.37,8.89 37.47,8.89
  Top 1.5: D10.A D18.A | 37.47,8.89 IC1.4
  Bottom 0.8: R3.1 T1.E 19.37,69.53 v17.78,71.12 | R4.1 T2.E 9.21,69.53 v7.62,71.12
  Bottom 1: R27.2 71.44,66.36 PIN43.PIN1 | R28.2 52.39,66.36 PIN44.PIN1 | R29.2 32.7,66.36 PIN45.PIN1 | T3.E R17.1 85.09,39.37 86.36,38.1 90.17,38.1 | T4.E R20.1 67.31,39.37 68.58,38.1 74.81,38.1 74.93,38.22 | ARDUINO-NANO1.GND2 v36.83,24.13 36.83,22.86 38.1,21.59 55.88,21.59 v57.15,22.86 63.5,22.86 64.77,21.59 64.77,16.51 63.82,15.56 RLS2.21 | RLS1.21 81.6,15.56 82.55,16.51 82.55,22.86 80.01,25.4 74.93,25.4 | C1.1 74.61,32.7 74.93,33.02 74.93,38.22 | 74.93,38.22 v74.93,41.91 | R12.2 v10.16,16.51 | v15.24,16.51 R10.2 R9.2 | R7.2 v24.13,16.51 | C6.2 74.93,25.4 | 74.93,25.4 v74.93,21.59 | v88.9,62.23 90.17,62.23 92.71,59.69 92.71,40.64 90.17,38.1 | 90.17,38.1 92.71,35.56 92.71,32.47 | C2.1 92.48,32.7 92.71,32.47 | C5.2 91.44,25.4 | 91.44,25.4 92.71,26.67 92.71,32.47 | 91.44,25.4 v92.71,24.13
GND_RESEAU  (via drill 0.8 pad 1.6)
  Top 1.5: D17.A v48.9,13.97 D18.C
  Bottom 1.5: v48.9,13.97 50.8,13.97 53.34,11.43 PIN13.PIN1
N$1
  Bottom 1: R24.2 76.52,65.72 77.47,64.77 80.01,64.77 | 80.01,64.77 OK1.1 | 80.01,64.77 80.01,58.42 81.28,57.15 OK2.2
N$2
  Bottom 1: D3.C D4.A
N$3
  Bottom 1: D11.A D12.C
N$4
  Top 0.8: LED5.C LED3.A 98.2,17.56 97.16,16.51 R19.1
N$5
  Bottom 1: T3.B R17.2 R13.2
N$6
  Bottom 1: D5.C D6.A
N$7  (via drill 0.8 pad 1.6)
  Top 0.8: v79.38,43.81 80.01,44.45 LED1.C
  Bottom 0.8: RLS1.A2 80.13,34.51 D1.A | T3.C 80.18,43.01 v79.38,43.81
  Bottom 1: RLS1.A2 80.13,41.86 T3.C
N$8
  Bottom 1: D13.A D14.C
N$9
  Top 0.8: LED1.A 84.87,45.94 83.82,46.99 69.85,46.99 67.31,49.53 58.42,49.53 54.68,45.79 54.61,45.72 R15.1
N$10
  Bottom 1: R25.2 57.47,65.72 58.42,64.77 61.02,64.77 | 61.02,64.77 OK3.1 | OK4.2 62.23,57.15 60.96,58.42 60.96,64.7 61.02,64.77
N$11
  Bottom 1: D7.C D8.A
N$12
  Bottom 1: D15.A D16.C
N$13
  Bottom 1: R26.2 37.78,65.72 38.73,64.77 41.38,64.77 | 41.38,64.77 OK5.1 | OK6.2 42.55,57.15 41.27,58.42 41.27,64.67 41.38,64.77
N$14  (via drill 0.8 pad 1.6)
  Top 0.8: v59.69,40.64 59.69,41.91 62.23,44.45 LED2.C
  Bottom 0.8: RLS2.A2 62.35,34.51 D2.A | 62.35,40.01 60.33,40.01 v59.69,40.64
  Bottom 1: RLS2.A2 62.35,40.01 62.35,41.86 T4.C
N$15
  Top 0.8: LED9.A R30.1
N$16
  Top 0.8: LED4.A LED6.C 94.39,17.56 93.34,16.51 R18.1
N$17
  Bottom 1: T4.B R20.2 R14.2
N$18
  Top 0.8: R16.1 57.15,43.18 60.96,46.99 66.04,46.99 67.09,45.94 LED2.A
N$19
  Bottom 1: ARDUINO-NANO1.GND1 PIN24.PIN1
N$20
  Bottom 0.8: T2.B R4.2 R2.2
N$21
  Bottom 1: PIN27.PIN1 ARDUINO-NANO1.D7
N$22
  Bottom 0.8: T1.B R3.2 R1.2
N$23
  Bottom 1: ARDUINO-NANO1.D8 PIN28.PIN1
N$24
  Top 0.8: LED7.A R31.1
N$25
  Bottom 1: ARDUINO-NANO1.A7 PIN29.PIN1
N$26
  Bottom 1: ARDUINO-NANO1.A6 PIN30.PIN1
N$27
  Bottom 1: ARDUINO-NANO1.A5 PIN31.PIN1
N$28
  Bottom 1: ARDUINO-NANO1.A4 PIN32.PIN1
N$29
  Bottom 1: ARDUINO-NANO1.A3 PIN33.PIN1
N$30
  Bottom 1: ARDUINO-NANO1.A2 PIN34.PIN1
N$33
  Bottom 1: ARDUINO-NANO1.D6 PIN26.PIN1
N$34
  Bottom 1: PIN25.PIN1 ARDUINO-NANO1.D5
N$35
  Bottom 1: PIN23.PIN1 ARDUINO-NANO1.RX0
N$36
  Bottom 1: ARDUINO-NANO1.TX1 PIN22.PIN1
N$37
  Bottom 1: R10.1 PIN4.PIN1
N$38
  Bottom 1: R7.1 PIN1.PIN1
N$39
  Bottom 1: ARDUINO-NANO1.REF PIN35.PIN1
N$40
  Bottom 1: ARDUINO-NANO1.3V3 PIN36.PIN1
N$41
  Bottom 1: ARDUINO-NANO1.D13 PIN37.PIN1
N$42
  Bottom 1: R12.1 PIN6.PIN1
N$43
  Bottom 1: R9.1 PIN3.PIN1
N$44
  Top 1: IC1.1 36.55,4.09 36.83,3.81 39.48,3.81 | 39.48,3.81 40.64,3.81 41.91,5.08 41.91,6.35 42.25,6.69 D9.C | C3.1 39.37,3.92 39.48,3.81
  Top 1.5: D9.C D17.C 43.18,14.9 FU3.1 48.19,17.85 48.26,17.78 FU1.1 FU2.1
N$45
  Top 0.8: LED8.A R32.1
PN1_LED+
  Bottom 0.8: PIN16.PIN1 R5.2
PN1_LED-
  Bottom 0.8: PIN17.PIN1 T1.C
PN2_LED+
  Bottom 0.8: PIN20.PIN1 R6.2
PN2_LED-
  Bottom 0.8: PIN21.PIN1 T2.C
RAIL+  (via drill 0.8 pad 1.6)
  Top 1: v48.26,69.85 v67.31,69.85 v86.36,69.85
  Bottom 1: 83.48,73.69 D12.A 83.48,67.97 R21.1 85.08,67.94 85.09,67.94 | 83.48,73.69 D4.C | OK2.1 OK1.2 85.09,62.23 85.09,67.94 | PIN10.PIN1 85.72,73.66 83.51,73.66 83.48,73.69 | 85.09,67.94 85.09,68.58 v86.36,69.85 | D6.C D14.A 64.43,67.97 R22.1 66.04,67.94 | 66.04,67.94 66.04,62.23 OK3.2 OK4.1 | 66.04,67.94 66.04,68.58 v67.31,69.85 | D8.C D16.A 44.74,67.97 R23.1 46.35,67.94 | 46.35,67.94 v48.26,69.85 | 46.35,67.94 46.35,62.23 OK5.2 OK6.1
TRANSPORT
  Bottom 1: R8.1 15.24,31.75 13.97,30.48 ARDUINO-NANO1.A1 13.97,21.59 16.51,19.05 20.32,19.05 21.59,17.78 PIN2.PIN1